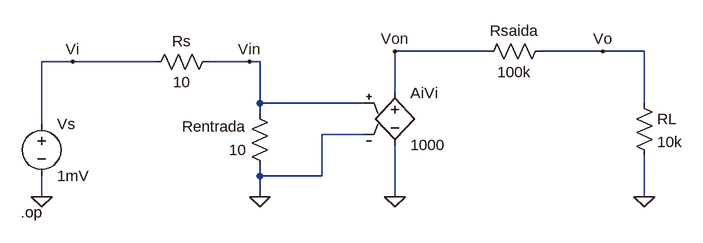
[diagram p0: schematic parte1.asc]
parte1.asc, the LTspice schematic file:
Version 4
SHEET 1 972 680
WIRE 640 64 496 64
WIRE 816 64 720 64
WIRE 880 64 816 64
WIRE 0 80 -48 80
WIRE 128 80 0 80
WIRE 272 80 208 80
WIRE 288 80 272 80
WIRE 496 128 496 64
WIRE 288 144 288 80
WIRE 448 144 288 144
WIRE 880 144 880 64
WIRE 288 160 288 144
WIRE -48 176 -48 80
WIRE 448 192 384 192
WIRE 288 256 288 240
WIRE 384 256 384 192
WIRE 384 256 288 256
WIRE -48 288 -48 256
WIRE 288 288 288 256
WIRE 496 288 496 208
WIRE 880 288 880 224
FLAG -48 288 0
FLAG 288 288 0
FLAG 496 288 0
FLAG 880 288 0
FLAG 816 64 Vo
FLAG 0 80 Vi
FLAG 272 80 Vin
FLAG 496 64 Von
SYMBOL voltage -48 160 R0
SYMATTR InstName Vs
SYMATTR Value 1mV
SYMBOL res 224 64 R90
WINDOW 0 0 56 VBottom 2
WINDOW 3 32 56 VTop 2
SYMATTR InstName Rs
SYMATTR Value 10
SYMBOL res 304 256 R180
WINDOW 0 36 76 Left 2
WINDOW 3 36 40 Left 2
SYMATTR InstName Rentrada
SYMATTR Value 10
SYMBOL e 496 112 R0
SYMATTR InstName AiVi
SYMATTR Value 1000
SYMBOL res 736 48 R90
WINDOW 0 0 56 VBottom 2
WINDOW 3 32 56 VTop 2
SYMATTR InstName Rsaida
SYMATTR Value 100k
SYMBOL res 864 128 R0
SYMATTR InstName RL
SYMATTR Value 10k
TEXT -80 312 Left 2 !.op

The netlist it stands for:
* parte1.asc
Vs Vi 0 1mV
Rs Vin Vi 10
Rentrada 0 Vin 10
E§AiVi Von 0 Vin 0 1000
Rsaida Vo Von 100k
RL Vo 0 10k
.op
.backanno
.end